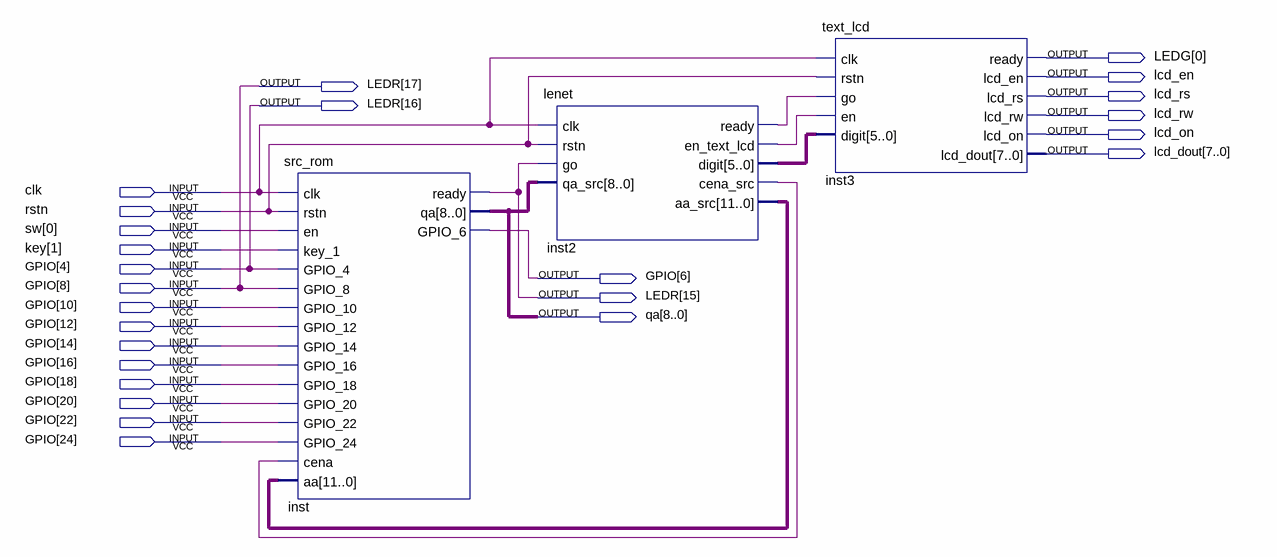
[diagram p0: schematic sheet]
// Quartus schematic RPI_BLOCK.bdf as structural Verilog: 3 symbols, 25 pins
module RPI_BLOCK (
  input  clk,
  input  rstn,
  input  [0:0] sw,
  input  [1:1] key,
  inout  [24:4] GPIO,
  output [0:0] LEDG,
  output lcd_en,
  output [17:15] LEDR,
  output lcd_rs,
  output lcd_rw,
  output lcd_on,
  output [7:0] lcd_dout,
  output [8:0] qa
);

  wire inst2_cena_src, inst2_en_text_lcd, inst2_ready;
  wire [5:0] inst2_digit;
  wire [11:0] inst2_aa_src;

  src_rom inst (
    .clk(clk), .rstn(rstn), .en(sw[0]), .key_1(key[1]), .GPIO_4(GPIO[4]), .GPIO_8(GPIO[8]),
    .GPIO_10(GPIO[10]), .GPIO_12(GPIO[12]), .GPIO_14(GPIO[14]), .GPIO_16(GPIO[16]), .GPIO_18(GPIO[18]),
    .GPIO_20(GPIO[20]), .GPIO_22(GPIO[22]), .GPIO_24(GPIO[24]), .cena(inst2_cena_src), .aa(inst2_aa_src),
    .ready(LEDR[15]), .qa(qa), .GPIO_6(GPIO[6]));
  lenet inst2 (
    .clk(clk), .rstn(rstn), .go(LEDR[15]), .qa_src(qa), .ready(inst2_ready), .en_text_lcd(inst2_en_text_lcd),
    .digit(inst2_digit), .cena_src(inst2_cena_src), .aa_src(inst2_aa_src));
  text_lcd inst3 (
    .clk(clk), .rstn(rstn), .go(inst2_ready), .en(inst2_en_text_lcd), .digit(inst2_digit), .ready(LEDG[0]),
    .lcd_en(lcd_en), .lcd_rs(lcd_rs), .lcd_rw(lcd_rw), .lcd_on(lcd_on), .lcd_dout(lcd_dout));

  assign LEDR[17:16] = {GPIO[8], GPIO[4]};
endmodule
